# Altium schematic sheet POWER.SchDoc
size A4
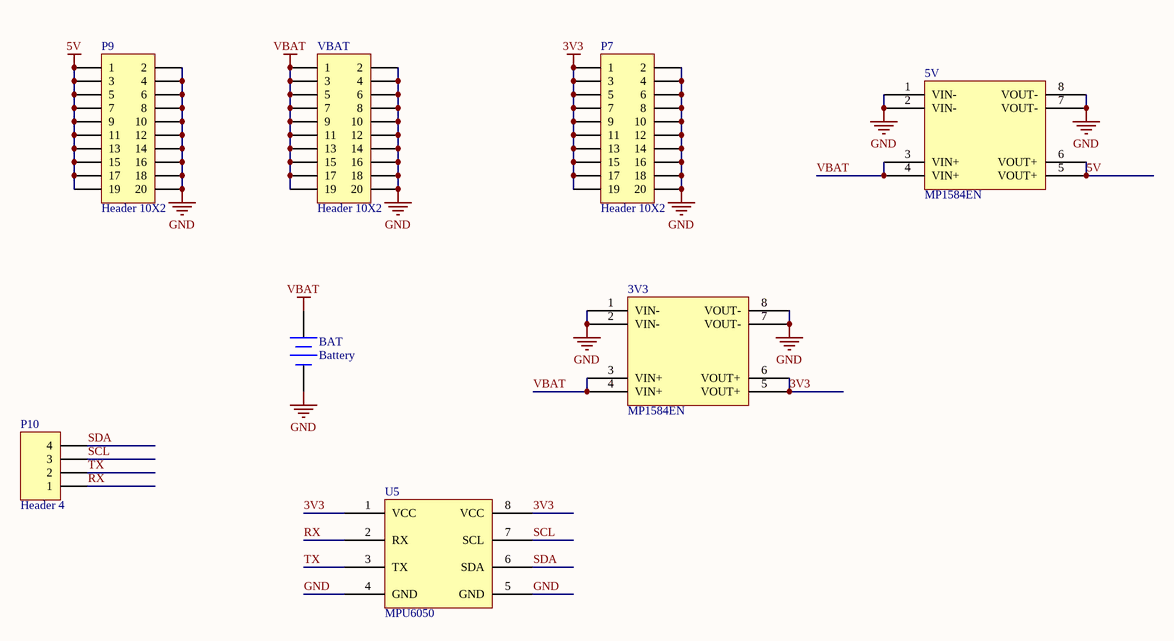
[diagram p0: POWER.SchDoc]

## Parts
3V3  MP1584EN  [PCBComponent_1]
5V  MP1584EN  [PCBComponent_1]
BAT  Battery  [BAT-2]
P7  Header 10X2  [HDR2X10]
P9  Header 10X2  [HDR2X10]
P10  Header 4  [HDR1X4]
U5  MPU6050  [MPU6050]
VBAT  Header 10X2  [HDR2X10]

## Nets
3V3: 3V3.5(VOUT+) 3V3.6(VOUT+) P7.1 P7.3 P7.5 P7.7 P7.9 P7.11 P7.13 P7.15 P7.17 P7.19 U5.1(VCC) U5.8(VCC)
5V: 5V.5(VOUT+) 5V.6(VOUT+) P9.1 P9.3 P9.5 P9.7 P9.9 P9.11 P9.13 P9.15 P9.17 P9.19
GND: 3V3.1(VIN-) 3V3.2(VIN-) 3V3.7(VOUT-) 3V3.8(VOUT-) 5V.1(VIN-) 5V.2(VIN-) 5V.7(VOUT-) 5V.8(VOUT-) BAT.2(-) P7.2 P7.4 P7.6 P7.8 P7.10 P7.12 P7.14 P7.16 P7.18 P7.20 P9.2 P9.4 P9.6 P9.8 P9.10 P9.12 P9.14 P9.16 P9.18 P9.20 U5.4(GND) U5.5(GND) VBAT.2 VBAT.4 VBAT.6 VBAT.8 VBAT.10 VBAT.12 VBAT.14 VBAT.16 VBAT.18 VBAT.20
VBAT: 3V3.3(VIN+) 3V3.4(VIN+) 5V.3(VIN+) 5V.4(VIN+) BAT.1(+) VBAT.1 VBAT.3 VBAT.5 VBAT.7 VBAT.9 VBAT.11 VBAT.13 VBAT.15 VBAT.17 VBAT.19
RX: P10.1 U5.2(RX)
SCL: P10.3 U5.7(SCL)
SDA: P10.4 U5.6(SDA)
TX: P10.2 U5.3(TX)

## Library data of the parts
BAT = Battery: Multicell Battery; Published: 24-Mar-1999; LatestRevisionDate: 17-Jul-2002; LatestRevisionNote: Re-released for DXP Platform.; PackageReference: BAT-2; Publisher: Altium Limited; PackageDescription: Battery; 2 Leads
P7 P9 VBAT = Header 10X2: Header, 10-Pin, Dual row; LatestRevisionDate: 17-Jul-2002; LatestRevisionNote: Re-released for DXP Platform.; Publisher: Altium Limited
P10 = Header 4: Header, 4-Pin; LatestRevisionDate: 17-Jul-2002; LatestRevisionNote: Re-released for DXP Platform.; Publisher: Altium Limited